# Altium schematic sheet TB6560AHQ_stepper_driver.SchDoc: TB6560 stepper motor driver
size A4; Author: Pavel Nadein; Revision: 1.0; SheetNumber: 1; SheetTotal: 1
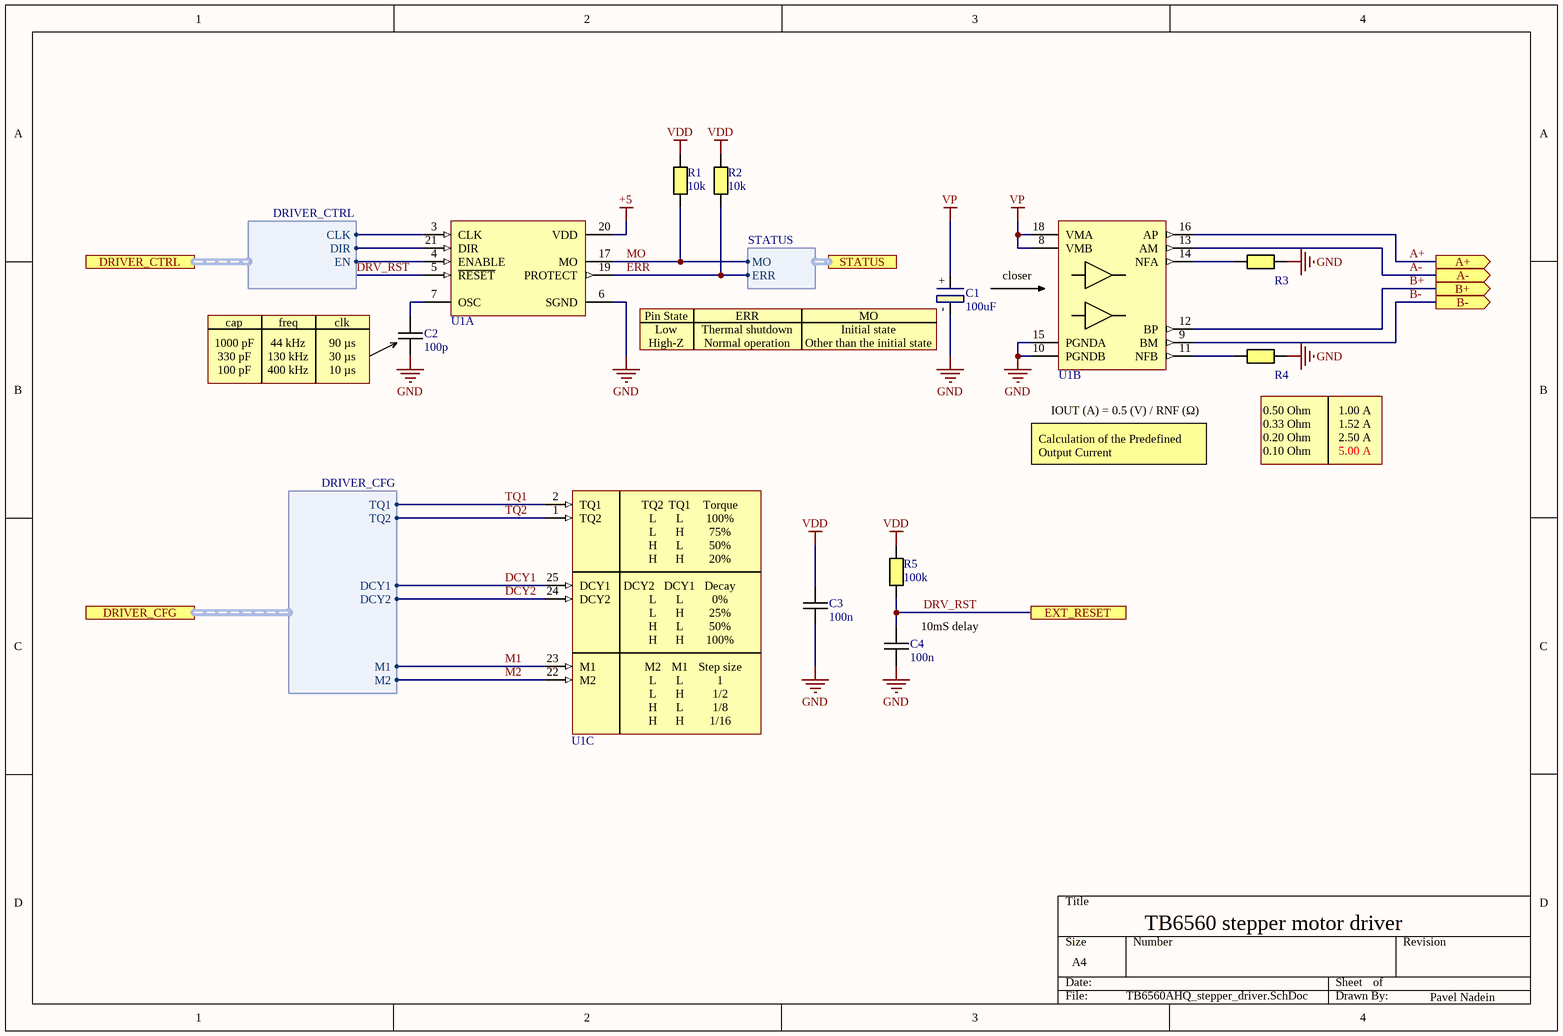
[diagram p0: TB6560AHQ_stepper_driver.SchDoc]

## Parts
C1  100uF  [10x10.5 Capacitor]
C2  100p  [CAPC0603(1608)55_N]
C3  100n  [CAPC0603(1608)55_N]
C4  100n  [CAPC0603(1608)55_N]
R1  10k  [RESC0603(1608)_N]
R2  10k  [RESC0603(1608)_N]
R3  TBD  [RESC2512(6432)_N]  (value not drawn)
R4  TBD  [RESC2512(6432)_N]  (value not drawn)
R5  100k  [RESC0603(1608)_N]
U1  STP DRIVER  [HZIP25_PCB]  (value not drawn)  (parts A,B,C of 3)

## Ports
A+ (out), A- (out), B+ (out), B- (out), DRIVER_CFG (harness DRIVER_CFG), DRIVER_CTRL (harness DRIVER_CTRL), EXT_RESET, STATUS (harness STATUS)

## Harnesses
DRIVER_CFG: TQ1, TQ2, DCY1, DCY2, M1, M2
DRIVER_CTRL: CLK, DIR, EN
STATUS: MO, ERR

## Nets
+5: U1.20(VDD)
GND: C1.- C2.2 C3.2 C4.2 R3.2 R4.2 U1.6(SGND) U1.10(PGNDB) U1.15(PGNDA)
VDD: C3.1 R1.2 R2.2 R5.2
VP: C1.+ U1.8(VMB) U1.18(VMA)
A+: U1.16(AP) ; port A+
A-: U1.13(AM) ; port A-
B+: U1.12(BP) ; port B+
B-: U1.9(BM) ; port B-
DCY1: U1.25(DCY1) ; port DRIVER_CFG.DCY1
DCY2: U1.24(DCY2) ; port DRIVER_CFG.DCY2
DRV_RST: C4.1 R5.1 U1.5(~{RESET}) ; port EXT_RESET
ERR: R2.1 U1.19(PROTECT) ; port STATUS.ERR
M1: U1.23(M1) ; port DRIVER_CFG.M1
M2: U1.22(M2) ; port DRIVER_CFG.M2
MO: R1.1 U1.17(MO) ; port STATUS.MO
TQ1: U1.2(TQ1) ; port DRIVER_CFG.TQ1
TQ2: U1.1(TQ2) ; port DRIVER_CFG.TQ2
NetC2_1: C2.1 U1.7(OSC)
NetR3_1: R3.1 U1.14(NFA)
NetR4_1: R4.1 U1.11(NFB)
NetU1_3: U1.3(CLK) ; port DRIVER_CTRL.CLK
NetU1_4: U1.4(ENABLE) ; port DRIVER_CTRL.EN
NetU1_21: U1.21(DIR) ; port DRIVER_CTRL.DIR

## Notes on the sheet
- Pin State
- ERR
- MO
- (near U1) closer
- 1000 pF
- 330 pF
- 100 pF
- cap
- 44 kHz
- 130 kHz
- 400 kHz
- freq
- (near C2) 90 µs
- (near C2) 30 µs
- 10 µs
- clk
- Low
- High-Z
- Thermal shutdown
- Normal operation
- (near C1) Initial state
- (near C1) Other than the initial state
- IOUT (A) = 0.5 (V) / RNF (Ω)
- (near R4) 0.50 Ohm
- 0.33 Ohm
- 0.20 Ohm
- 0.10 Ohm
- 1.00 A
- 1.52 A
- 2.50 A
- 5.00 A
- Calculation of the Predefined Output Current
  To perform a constant current drive, the reference current should be adjusted by an external resistor.
  Charging stops when the NFA (NFB) voltage reaches 0.5 V (when the torque setting is 100 %) so that a
  current does not exceed the predefined level.
- (near C4) 10mS delay
- (in symbol TB6560AHQ, part C) Torque; L; 100%; H; 75%; 50%; 20%; Decay; 0%; 25%; Step size; 1/2; 1/8; 1/16

## Library data of the parts
C1 = Capacitor Electrolitic: Value: 100uF
C2-C4 = Capacitor M: Ceramic capacitor Medium density
  C2: Value: 100p
  C3 C4: Value: 100n
R1-R5 = Resistor M: Resistor Medium Density
  R1 R2: Value: 10k
  R3 R4: Value: TBD
  R5: Value: 100k
U1 = TB6560AHQ: PWM chopper-type stepping motor / driver IC designed for sinusoidal-input microstep control of / bipolar stepping motors; VDSS Max: 40V; I out: 3.5 A; VDD: 5V